# Altium schematic sheet Main.SchDoc
size A4; SheetNumber: 1; SheetTotal: 10
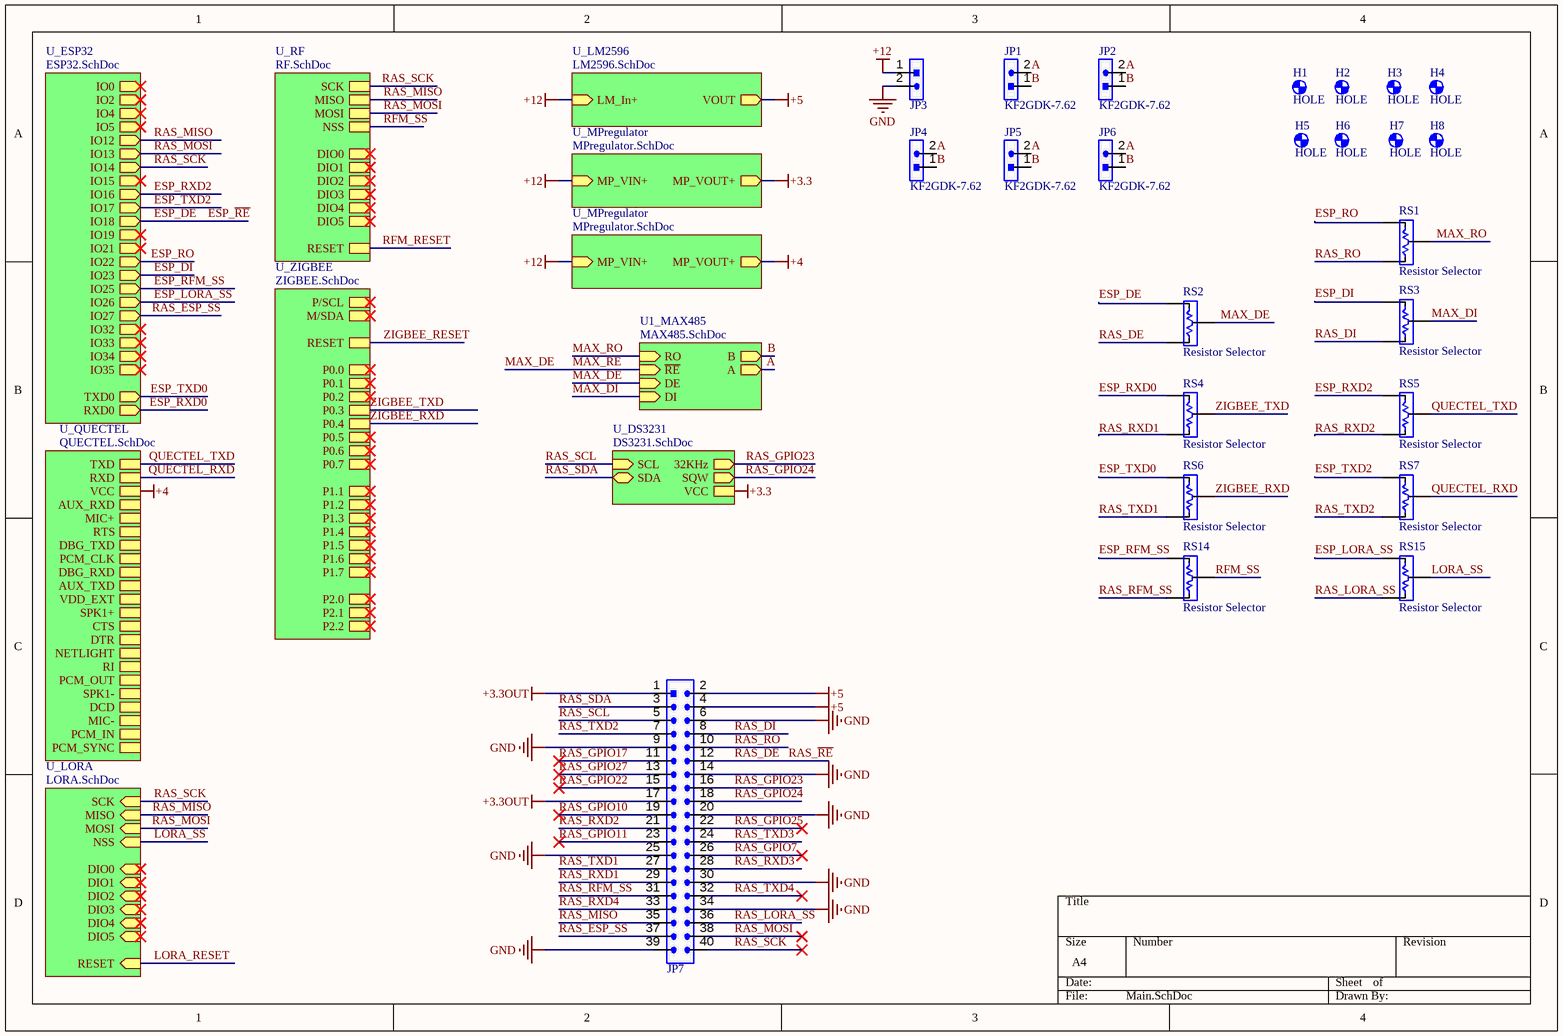
[diagram p0: Main.SchDoc]

## Parts
H1  HOLE  [P2.8]  (no BOM)
H2  HOLE  [P2.8]  (no BOM)
H3  HOLE  [P2.8]  (no BOM)
H4  HOLE  [P2.8]  (no BOM)
H5  HOLE  [P2.8]  (no BOM)
H6  HOLE  [P2.8]  (no BOM)
H7  HOLE  [P2.8]  (no BOM)
H8  HOLE  [P2.8]  (no BOM)
JP1  KF2GDK-7.62  [KF2EDGK-2P_H_7.62]
JP2  KF2GDK-7.62  [KF2EDGK-2P_H_7.62]
JP3  HDR-1X2  [KF2EDGK-2P_H_7.62]  (value not drawn)
JP4  KF2GDK-7.62  [KF2EDGK-2P_H_7.62]
JP5  KF2GDK-7.62  [KF2EDGK-2P_H_7.62]
JP6  KF2GDK-7.62  [KF2EDGK-2P_H_7.62]
JP7  Header 2X11  [HDR-20X2]  (value not drawn)
RS1  Resistor Selector  [RS 0805]
RS2  Resistor Selector  [RS 0805]
RS3  Resistor Selector  [RS 0805]
RS4  Resistor Selector  [RS 0805]
RS5  Resistor Selector  [RS 0805]
RS6  Resistor Selector  [RS 0805]
RS7  Resistor Selector  [RS 0805]
RS14  Resistor Selector  [RS 0805]
RS15  Resistor Selector  [RS 0805]

## Sub-sheets
U1_MAX485 = MAX485.SchDoc: RO (in), ~{RE} (in), DE (in), DI (in), B (out), A (out)
U_DS3231 = DS3231.SchDoc: 32KHz (out), SQW (out), SCL (in), SDA (bidir), VCC
U_ESP32 = ESP32.SchDoc: IO2 (out), IO4 (out), IO5 (out), IO12 (out), IO13 (out), IO14 (out), IO15 (out), IO16 (out), IO17 (out), IO18 (out), IO19 (out), IO21 (out), IO22 (out), IO23 (out), IO25 (out), IO26 (out), IO27 (out), IO32 (out), IO33 (out), IO34 (out), IO35 (out), TXD0 (out), RXD0 (out), IO0 (out)
U_LM2596 = LM2596.SchDoc: LM_In+ (in), VOUT (out)
U_LORA = LORA.SchDoc: DIO4 (in), DIO3 (in), DIO5 (in), RESET (in), NSS (in), SCK (in), MISO (in), DIO0 (in), DIO1 (in), DIO2 (in), MOSI (in)
U_MPregulator = MPregulator.SchDoc: MP_VOUT+ (out), MP_VIN+ (in)
U_MPregulator = MPregulator.SchDoc: MP_VOUT+ (out), MP_VIN+ (in)
U_QUECTEL = QUECTEL.SchDoc: RXD, TXD, RI, AUX_RXD, MIC+, RTS, DBG_TXD, PCM_CLK, DBG_RXD, AUX_TXD, VDD_EXT, SPK1+, CTS, DTR, NETLIGHT, VCC, PCM_OUT, SPK1-, DCD, MIC-, PCM_IN, PCM_SYNC
U_RF = RF.SchDoc: SCK, NSS, MOSI, MISO, DIO0, DIO1, DIO2, DIO3, DIO4, DIO5, RESET
U_ZIGBEE = ZIGBEE.SchDoc: P2.2, P2.1, P2.0, P1.7, P1.6, P/SCL, M/SDA, P1.5, P1.4, P1.3, RESET, P0.0, P0.1, P0.2, P0.3, P0.4, P0.5, P0.6, P0.7, P1.1, P1.2

## Nets
+3.3: sheet U_MPregulator/MP_VOUT+, sheet U_DS3231/VCC
+3.3OUT: JP7.1 JP7.17
+4: sheet U_QUECTEL/VCC, sheet U_MPregulator/MP_VOUT+
+5: JP7.2 JP7.4 ; sheet U_LM2596/VOUT
+12: JP3.1 ; sheet U_LM2596/LM_In+, sheet U_MPregulator/MP_VIN+, sheet U_MPregulator/MP_VIN+
GND: JP3.2 JP7.6 JP7.9 JP7.14 JP7.20 JP7.25 JP7.30 JP7.34 JP7.39
A: JP1.2 JP2.2 JP4.2 JP5.2 JP6.2 ; sheet U1_MAX485/A
B: JP1.1 JP2.1 JP4.1 JP5.1 JP6.1 ; sheet U1_MAX485/B
ESP_DE: RS2.2 ; sheet U_ESP32/IO18  [also labelled ESP_~{RE}]
ESP_DI: RS3.2 ; sheet U_ESP32/IO23
ESP_LORA_SS: RS15.2 ; sheet U_ESP32/IO26
ESP_RFM_SS: RS14.2 ; sheet U_ESP32/IO25
ESP_RO: RS1.2 ; sheet U_ESP32/IO22
ESP_RXD0: RS4.2 ; sheet U_ESP32/RXD0
ESP_RXD2: RS5.2 ; sheet U_ESP32/IO16
ESP_TXD0: RS6.2 ; sheet U_ESP32/TXD0
ESP_TXD2: RS7.2 ; sheet U_ESP32/IO17
LORA_RESET: sheet U_LORA/RESET
LORA_SS: RS15.3 ; sheet U_LORA/NSS
MAX_DE: RS2.3 ; sheet U1_MAX485/~{RE}, sheet U1_MAX485/DE  [also labelled MAX_~{RE}]
MAX_DI: RS3.3 ; sheet U1_MAX485/DI
MAX_RO: RS1.3 ; sheet U1_MAX485/RO
QUECTEL_RXD: RS7.3 ; sheet U_QUECTEL/RXD
QUECTEL_TXD: RS5.3 ; sheet U_QUECTEL/TXD
RAS_DE: JP7.12 RS2.1  [also labelled RAS_~{RE}]
RAS_DI: JP7.8 RS3.1
RAS_ESP_SS: JP7.37 ; sheet U_ESP32/IO27
RAS_GPIO7: JP7.26
RAS_GPIO10: JP7.19
RAS_GPIO11: JP7.23
RAS_GPIO17: JP7.11
RAS_GPIO22: JP7.15
RAS_GPIO23: JP7.16 ; sheet U_DS3231/32KHz
RAS_GPIO24: JP7.18 ; sheet U_DS3231/SQW
RAS_GPIO25: JP7.22
RAS_GPIO27: JP7.13
RAS_LORA_SS: JP7.36 RS15.1
RAS_MISO: JP7.35 ; sheet U_ESP32/IO12, sheet U_LORA/MISO, sheet U_RF/MISO
RAS_MOSI: JP7.38 ; sheet U_ESP32/IO13, sheet U_LORA/MOSI, sheet U_RF/MOSI
RAS_RFM_SS: JP7.31 RS14.1
RAS_RO: JP7.10 RS1.1
RAS_RXD1: JP7.29 RS4.1
RAS_RXD2: JP7.21 RS5.1
RAS_RXD3: JP7.28
RAS_RXD4: JP7.33
RAS_SCK: JP7.40 ; sheet U_ESP32/IO14, sheet U_LORA/SCK, sheet U_RF/SCK
RAS_SCL: JP7.5 ; sheet U_DS3231/SCL
RAS_SDA: JP7.3 ; sheet U_DS3231/SDA
RAS_TXD1: JP7.27 RS6.1
RAS_TXD2: JP7.7 RS7.1
RAS_TXD3: JP7.24
RAS_TXD4: JP7.32
RFM_RESET: sheet U_RF/RESET
RFM_SS: RS14.3 ; sheet U_RF/NSS
ZIGBEE_RESET: sheet U_ZIGBEE/RESET
ZIGBEE_RXD: RS6.3 ; sheet U_ZIGBEE/P0.4
ZIGBEE_TXD: RS4.3 ; sheet U_ZIGBEE/P0.3

## Library data of the parts
H1-H8 = MOUNT-HOLE: MOUNTING HOLE with drill center marker; Rule: UNIONINDEX=0|RULEKIND=Clearance|NETSCOPE=DifferentNets|LAYERKIND=SameLayer|NAME=Schematic Clearance Constraint|GAP=0mil|GENERICCLEARANCE=0mil|IGNOREPADTOPADCLEARANCEINFOOTPRINT=FALSE|OBJECTCLEARANCES= |UNIT=Metric
JP1-JP6 = Header 2: 2P Connector; BOM名称: 2P接插件; 版权归属: 源创客; 学习资源: www.ooocke.com
JP7 = Header 20X2: 20*2P Connector; BOM名称: 20*2P接插件; 版权归属: 源创客; 学习资源: www.ooocke.com